# EasyEDA schematic SCH_23x10 IO EXTENDER_2023-06-17.json
TITLE: Sheet_1; REV: 1.0; Date: 2023-05-22; Sheet: 1/1; Drawn By: pierluigi colangeli; Company: Lualtek S.r.l.
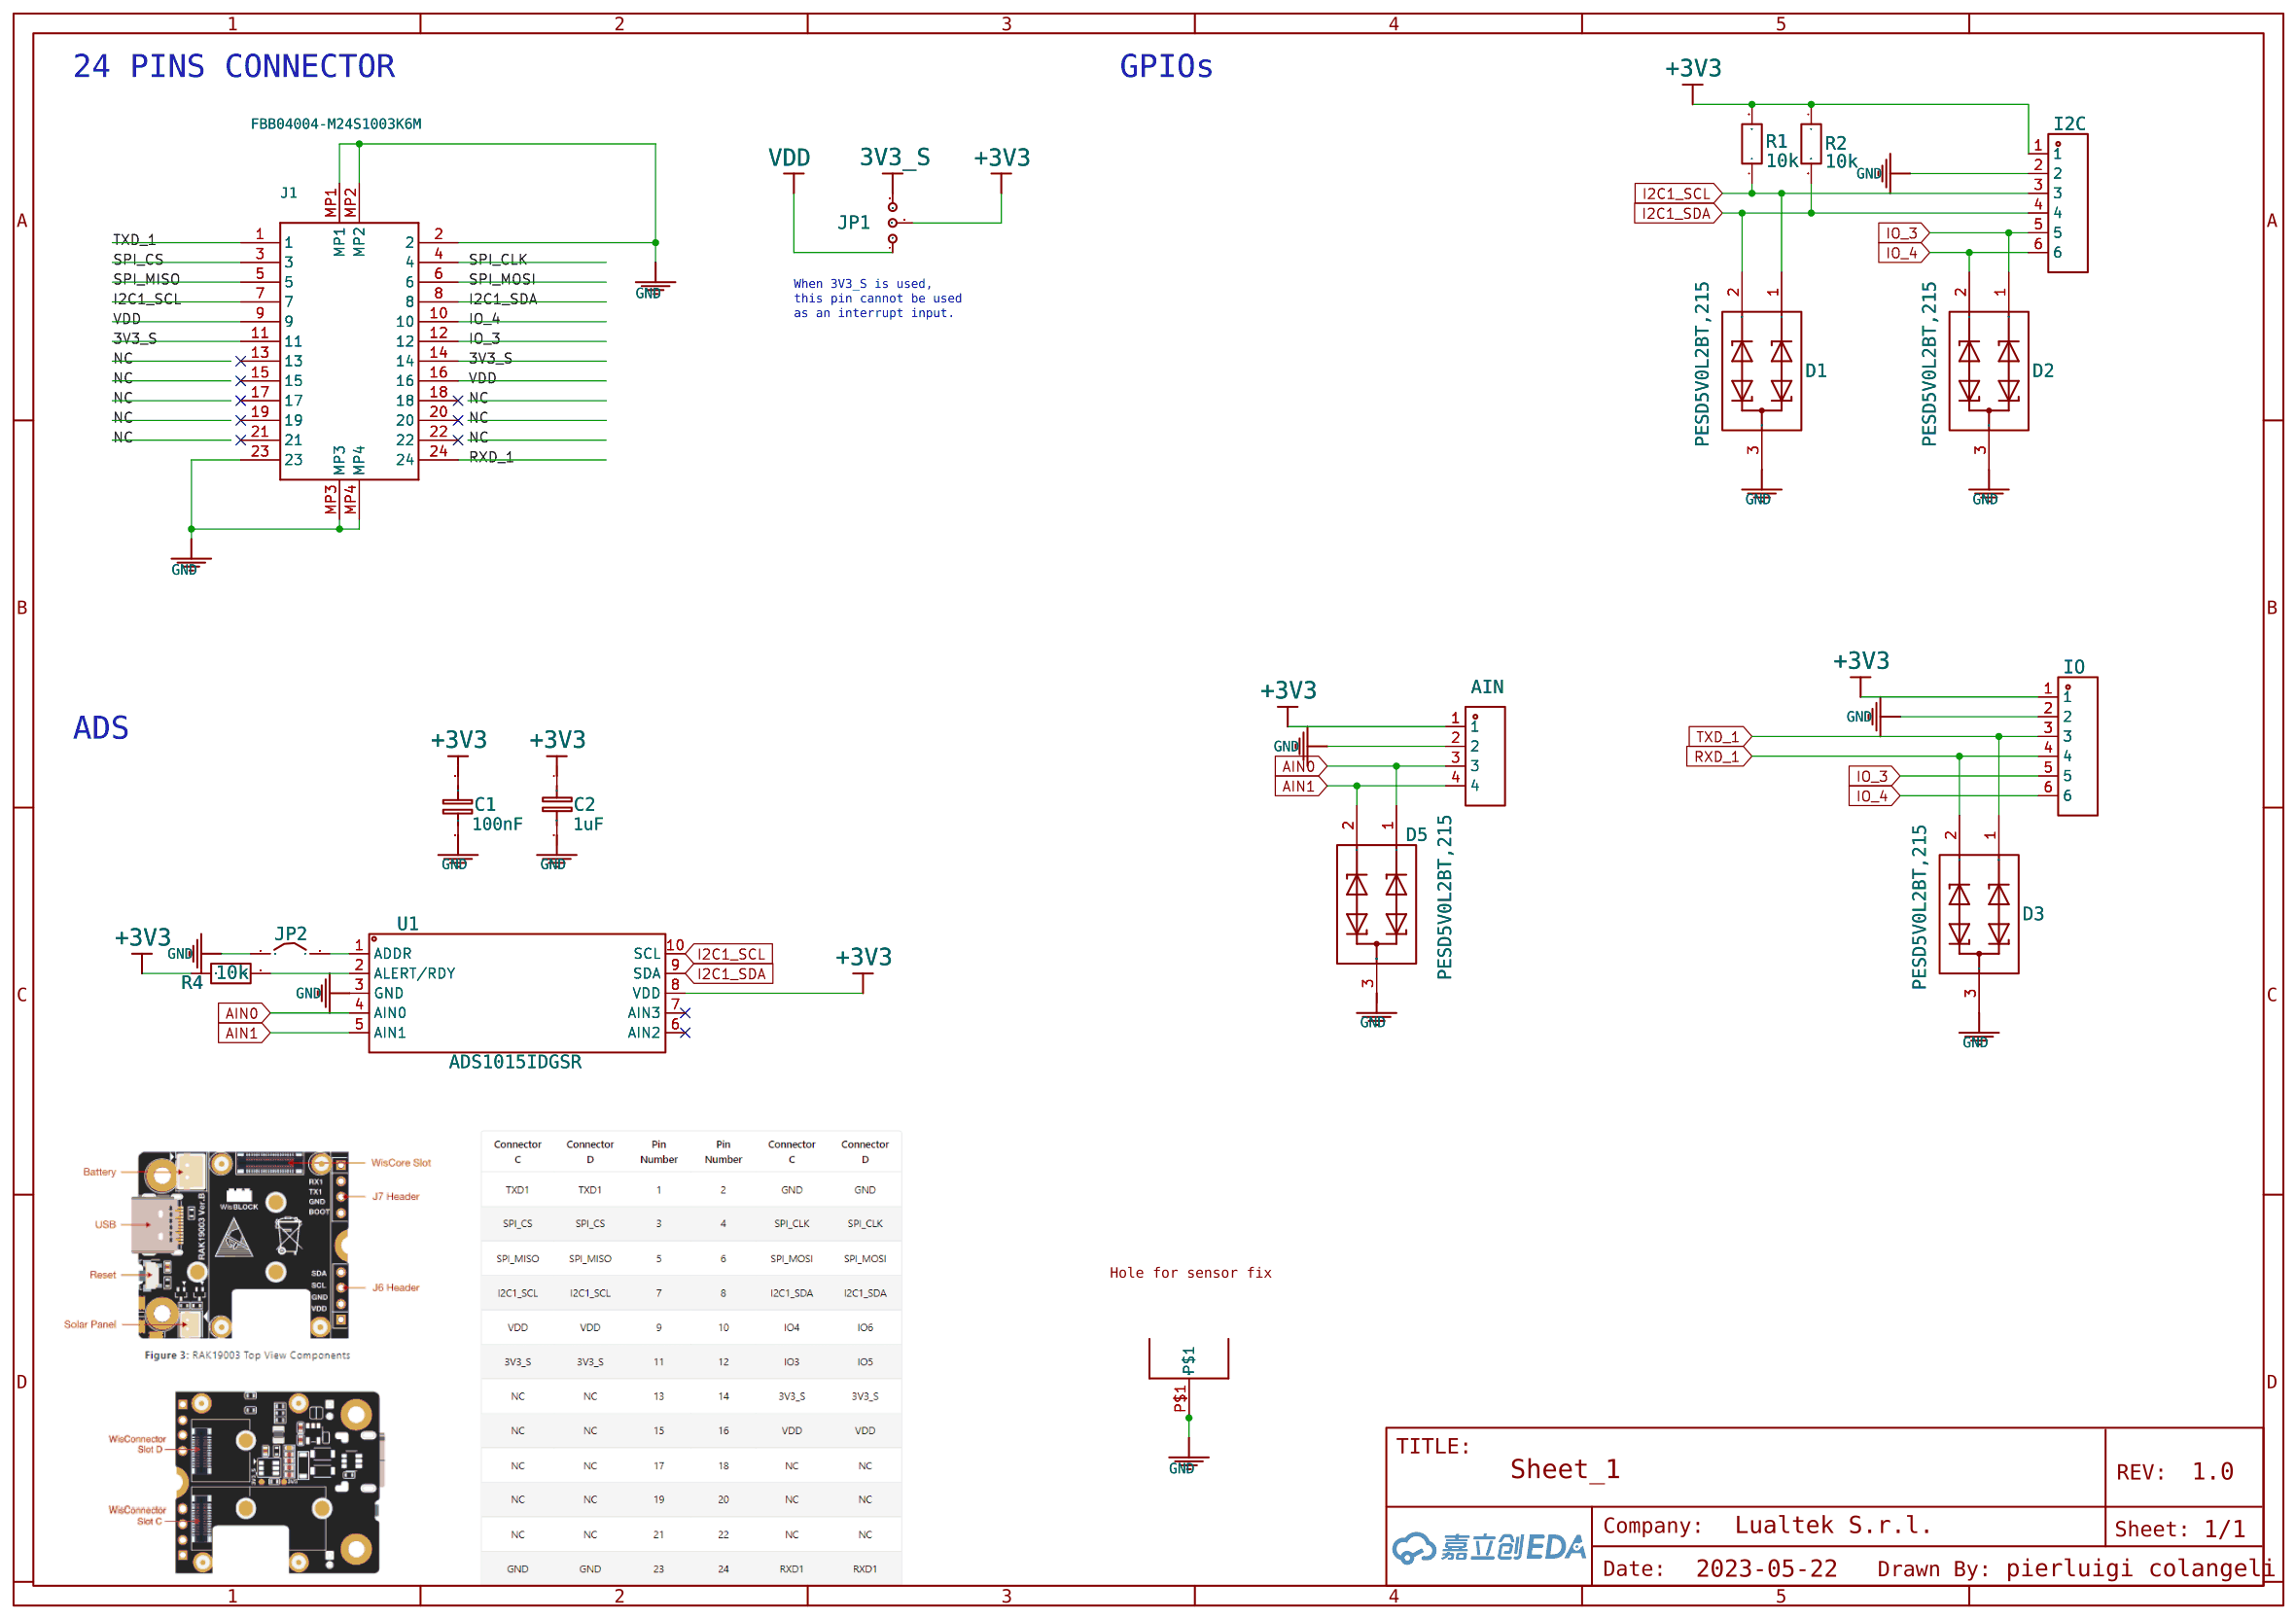
[diagram p0: schematic sheet]

## Parts
AIN  J3  [CONN-SMD_4P-P1.00_SM04B-SRSS-TB-LF-SN]
C1  100nF  [C0603]
C2  1uF  [C0603]
D1  PESD5V0L2BT,215  [SOT-23-3_L2.9-W1.3-P1.90-LS2.4-BR]
D2  PESD5V0L2BT,215  [SOT-23-3_L2.9-W1.3-P1.90-LS2.4-BR]
D3  PESD5V0L2BT,215  [SOT-23-3_L2.9-W1.3-P1.90-LS2.4-BR]
D5  PESD5V0L2BT,215  [SOT-23-3_L2.9-W1.3-P1.90-LS2.4-BR]
I2C  J1  [SM06B-SRSS-TB(LF)(SN)]
IO  J1  [SM06B-SRSS-TB(LF)(SN)]
J1  FBB04004-M24S1003K6M  [FBB04004M24S1003K6M]
JP1  JUMPER_3WAY_NO_SMALL  [0603_SOLDER_JUMPER_3WAY_NO]
JP2  Jumper  [PAD-JUMPER-2-SMD-SOLDER]
R1  10k  [R0603]
R2  10k  [R0603]
R4  10k  [R0603]
U1  ADS1015IDGSR  [VSSOP-10_L3.0-W3.0-P0.50-LS4.9-BL]
U$1  RAK_SENSOR_FIX  [RAK_SENSOR_FIX_PC]

## Library data of the parts
AIN = JST SH 4 pin side entry: Manufacturer: JST; Manufacturer Part: SM04B-SRSS-TB; Supplier: jst-mfg.com; Supplier Part: SM02B-SRSS-TB; link: https://www.jst-mfg.com/product/detail_e.php?series=231; Contributor: Tobias van der Most
C1 = C_0603_EU: Supplier Part: C14663; Supplier: LCSC; Contributor: LCEDA_Lib; Manufacturer Part: CC0603KRX7R9BB104; Manufacturer: YAGEO(国巨)
C2 = C_0603_EU: Supplier Part: C15849; Supplier: LCSC; Contributor: LCEDA_Lib; Manufacturer Part: CL10A105KB8NNNC; Manufacturer: SAMSUNG(三星)
D1-D3 D5 = PESD5V0L2BT,215: Supplier: LCSC; Manufacturer: Nexperia(安世); Supplier Part: C12324; JLCPCB Part Class: Extended Part
I2C IO = JST SH 6 pin side entry: Manufacturer: JST; Manufacturer Part: SM06B-SRSS-TB; Supplier: jst-mfg.com; Supplier Part: SM06B-SRSS-TB; link: https://www.jst-mfg.com/product/detail_e.php?series=231; Contributor: Tobias van der Most
JP1 = JUMPER_3WAY_NO_SMALL: Contributor: aafshar
JP2 = Jumper Solder Bridge SMD: Contributor: Gamma_001
R1 R2 = R_0603_EU: Supplier Part: C25804; Supplier: LCSC; Contributor: LCEDA_Lib; Manufacturer Part: 0603WAF1002T5E; Manufacturer: UNI-ROYAL(厚声)
R4 = R_0805_EU: Supplier Part: C25804; Supplier: LCSC; Contributor: LCEDA_Lib; Manufacturer Part: 0603WAF1002T5E; Manufacturer: UNI-ROYAL(厚声)
U1 = ADS1015IDGSR: Supplier: LCSC; Supplier Part: C193969; Manufacturer: TI(德州仪器); Contributor: LCSC; JLCPCB Part Class: Extended Part

## Nets
3V3_S: J1.11 J1.14 JP1.3
+3V3: AIN.1 C1.2 C2.1 I2C.1 IO.1 JP1.2 R1.2 R2.1 R4.1 U1.8(VDD)
GND: AIN.2 C1.1 C2.2 D1.3(DC) D2.3(DC) D3.3(DC) D5.3(DC) I2C.2 IO.2 J1.2 J1.23 J1.MP1 J1.MP2 J1.MP3 J1.MP4 JP2.1 U1.3(GND) U$1.P$1 U$1.P$2(P$1)
VDD: J1.9 J1.16 JP1.1
AIN0: AIN.3 D5.1(C1) U1.4(AIN0)
AIN1: AIN.4 D5.2(C2) U1.5(AIN1)
I2C1_SCL: D1.1(C1) I2C.3 J1.7 R1.1 U1.10(SCL)
I2C1_SDA: D1.2(C2) I2C.4 J1.8 R2.2 U1.9(SDA)
IO_3: D2.1(C1) I2C.5 IO.5 J1.12
IO_4: D2.2(C2) I2C.6 IO.6 J1.10
RXD_1: D3.2(C2) IO.4 J1.24
SPI_CLK: J1.4
SPI_CS: J1.3
SPI_MISO: J1.5
SPI_MOSI: J1.6
TXD_1: D3.1(C1) IO.3 J1.1
Net-(JP2-2): JP2.2 U1.1(ADDR)
Net-(R4-2): R4.2 U1.2(ALERT/RDY)

Not connected (* = marked no-connect by the designer): J1 13* 15* 17* 18* 19* 20* 21* 22*; U1 6(AIN2)* 7(AIN3)*

## Notes on the sheet
- 24 PINS CONNECTOR
- GPIOs
- When 3V3_S is used,
  this pin cannot be used
  as an interrupt input.
- ADS
